# EAGLE design DefenderV1 (EAGLE 7.3.0)
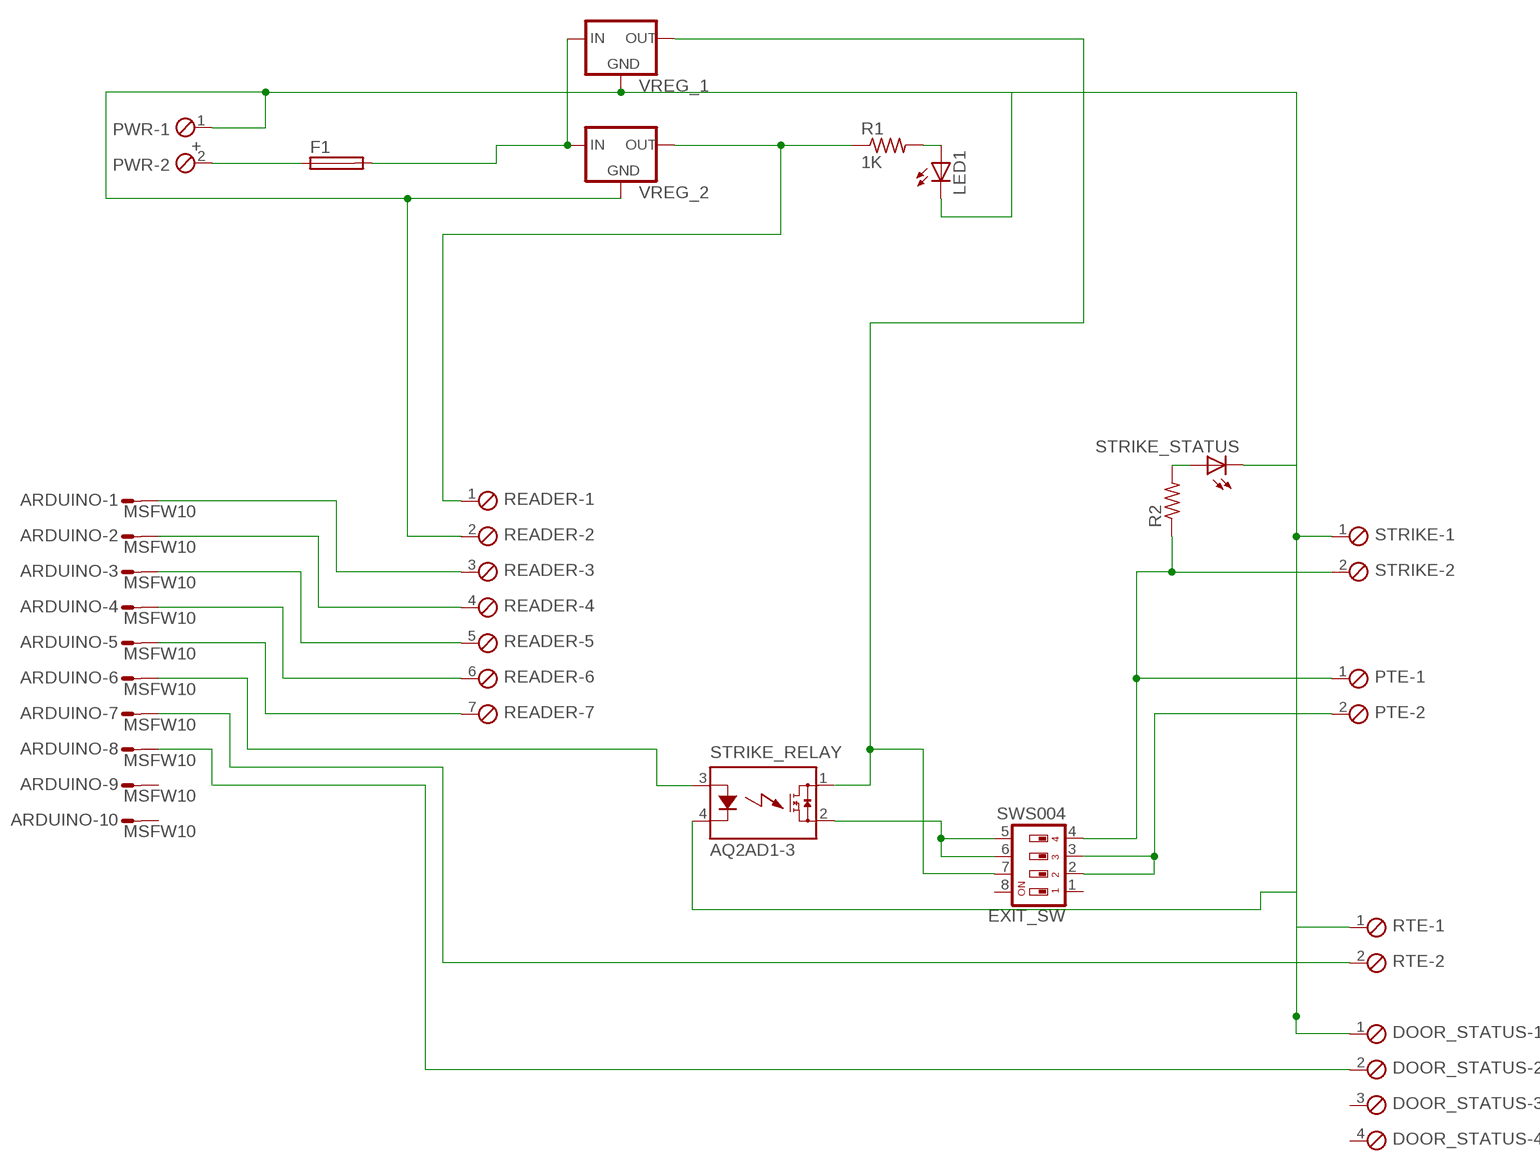
[diagram p0: schematic, sheet 1]

## Parts
ARDUINO  MSFW10  [MSFW10]
DOOR_STATUS  MPT4  [4POL254]
EXIT_SW  SWS004  [SMS-004]
F1  GSH15  [GSH15]
LED1  LED5MM  [LED5MM]
PTE  MPT2  [2POL254]
PWR  +  MPT2  [2POL254]
R1  1K  R-US_0204/7  [0204/7]
R2  R-US_0204/7  [0204/7]
READER  MPT7  [7POL254]
RTE  MPT2  [2POL254]
STRIKE  MPT2  [2POL254]
STRIKE_RELAY  AQ2AD1-3  [AQ1]
STRIKE_STATUS  LED5MM  [LED5MM]
VREG_1  78XXL  [78XXL]
VREG_2  78XXL  [78XXL]

## Nets
N$1: F1.2 VREG_1.IN VREG_2.IN
N$2: F1.1 PWR.2
N$4: DOOR_STATUS.1 LED1.K(C) PWR.1 READER.2 RTE.1 STRIKE.1 STRIKE_RELAY.4(K) STRIKE_STATUS.K(C) VREG_1.GND VREG_2.GND
N$5: ARDUINO.1 READER.3
N$6: ARDUINO.2 READER.4
N$8: ARDUINO.3 READER.5
N$9: EXIT_SW.5 EXIT_SW.6 STRIKE_RELAY.2(DS2)
N$10: R2.2 STRIKE_STATUS.A
N$11: ARDUINO.4 READER.6
N$12: EXIT_SW.4 PTE.1 R2.1 STRIKE.2
N$13: EXIT_SW.2 EXIT_SW.3 PTE.2
N$15: LED1.A R1.2
N$16: ARDUINO.5 READER.7
N$17: ARDUINO.6 STRIKE_RELAY.3(A)
N$18: ARDUINO.7 RTE.2
N$19: EXIT_SW.7 STRIKE_RELAY.1(DS1) VREG_1.OUT
N$20: ARDUINO.8 DOOR_STATUS.2
N$22: R1.1 READER.1 VREG_2.OUT
Unconnected: ARDUINO.9 ARDUINO.10 DOOR_STATUS.3 DOOR_STATUS.4 EXIT_SW.1 EXIT_SW.8

## Library data of the parts
ARDUINO = con-lumberg:MSFW10: MSF CONNECTOR; OC_FARNELL: unknown; OC_NEWARK: unknown
DOOR_STATUS = con-phoenix-254:MPT4: PHOENIX CONNECTOR; OC_FARNELL: unknown; OC_NEWARK: unknown
EXIT_SW = smd-special:SWS004: SMD Dip Switch 4 pol.
F1 = fuse:GSH15: FUSE HOLDER grid 15mm, 19649 Wickmann; MPN: 64900001039; OC_FARNELL: 1271673; OC_NEWARK: 02P0318
LED1 STRIKE_STATUS = led:LED: LED OSRAM: - CHIPLED LG R971, LG N971, LY N971, LG Q971, LY Q971, LO R971, LY R971 LH N974, LH R974 LS Q976, LO Q976, LY Q976 LO Q996 - Hyper CHIPLED LW Q18S LB Q993, LB Q99A, LB R99A - SideLED LS A670, LO A670, LY A670, LG A670, LP A670 LB A673, LV A673, LT A673, LW A673 LH A674 LY A675 LS A676, LA A676, LO A676, LY A676, LW A676 LS A679, LY A679, LG A679 - Hyper Micro SIDELED® LS Y876, LA Y876, LO Y876, LY Y876 LT Y87S - SmartLED LW L88C, LW L88S LB L89C, LB L89S, LG L890 LS L89K, LO L89K, LY L89K LS L896, LA L896, LO L896, LY L896 - TOPLED LS T670, LO T670, LY T670, LG T670, LP T670 LSG T670, LSP T670, LSY T670, LOP T670, LYG T670 LG T671, LOG T671, LSG T671 LB T673, LV T673, LT T673, LW T673 LH T674 LS T676, LA T676, LO T676, LY T676, LB T676, LH T676, LSB T676, LW T676 LB T67C, LV T67C, LT T67C, LS T67K, LO T67K, LY T67K, LW E67C LS E67B, LA E67B, LO E67B, LY E67B, LB E67C, LV E67C, LT E67C LW T67C LS T679, LY T679, LG T679 LS T770, LO T770, LY T770, LG T770, LP T770 LB T773, LV T773, LT T773, LW T773 LH T774 LS E675, LA E675, LY E675, LS T675 LS T776, LA T776, LO T776, LY T776, LB T776 LHGB T686 LT T68C, LB T68C - Hyper Mini TOPLED® LB M676 - Mini TOPLED Santana® LG M470 LS M47K, LO M47K, LY M47K Source: http://www.osram.convergy.de LUXEON: - LUMILED® LXK2-PW12-R00, LXK2-PW12-S00, LXK2-PW14-U00, LXK2-PW14-V00 LXK2-PM12-R00, LXK2-PM12-S00, LXK2-PM14-U00 LXK2-PE12-Q00, LXK2-PE12-R00, LXK2-PE12-S00, LXK2-PE14-T00, LXK2-PE14-U00 LXK2-PB12-K00, LXK2-PB12-L00, LXK2-PB12-M00, LXK2-PB14-N00, LXK2-PB14-P00, LXK2-PB14-Q00 LXK2-PR12-L00, LXK2-PR12-M00, LXK2-PR14-Q00, LXK2-PR14-R00 LXK2-PD12-Q00, LXK2-PD12-R00, LXK2-PD12-S00 LXK2-PH12-R00, LXK2-PH12-S00 LXK2-PL12-P00, LXK2-PL12-Q00, LXK2-PL12-R00 Source: www.luxeon.com KINGBRIGHT: KA-3528ASYC Source: www.kingbright.com
PTE PWR RTE STRIKE = con-phoenix-254:MPT2: PHOENIX CONNECTOR; OC_FARNELL: unknown; OC_NEWARK: unknown
R1 R2 = rcl:R-US_: RESISTOR, American symbol
READER = con-phoenix-254:MPT7: PHOENIX CONNECTOR; OC_FARNELL: unknown; OC_NEWARK: unknown
STRIKE_RELAY = relay:AQ*: SOLID STATE RELAY NAiS Source: http://www.mew-europe.com/.. en_ds_61601_0000.pdf; MPN: AQ2AD1-3/28VDC; OC_FARNELL: unknown; OC_NEWARK: 13P1229
VREG_1 VREG_2 = v-reg:78XXL: VOLTAGE REGULATOR

## Board
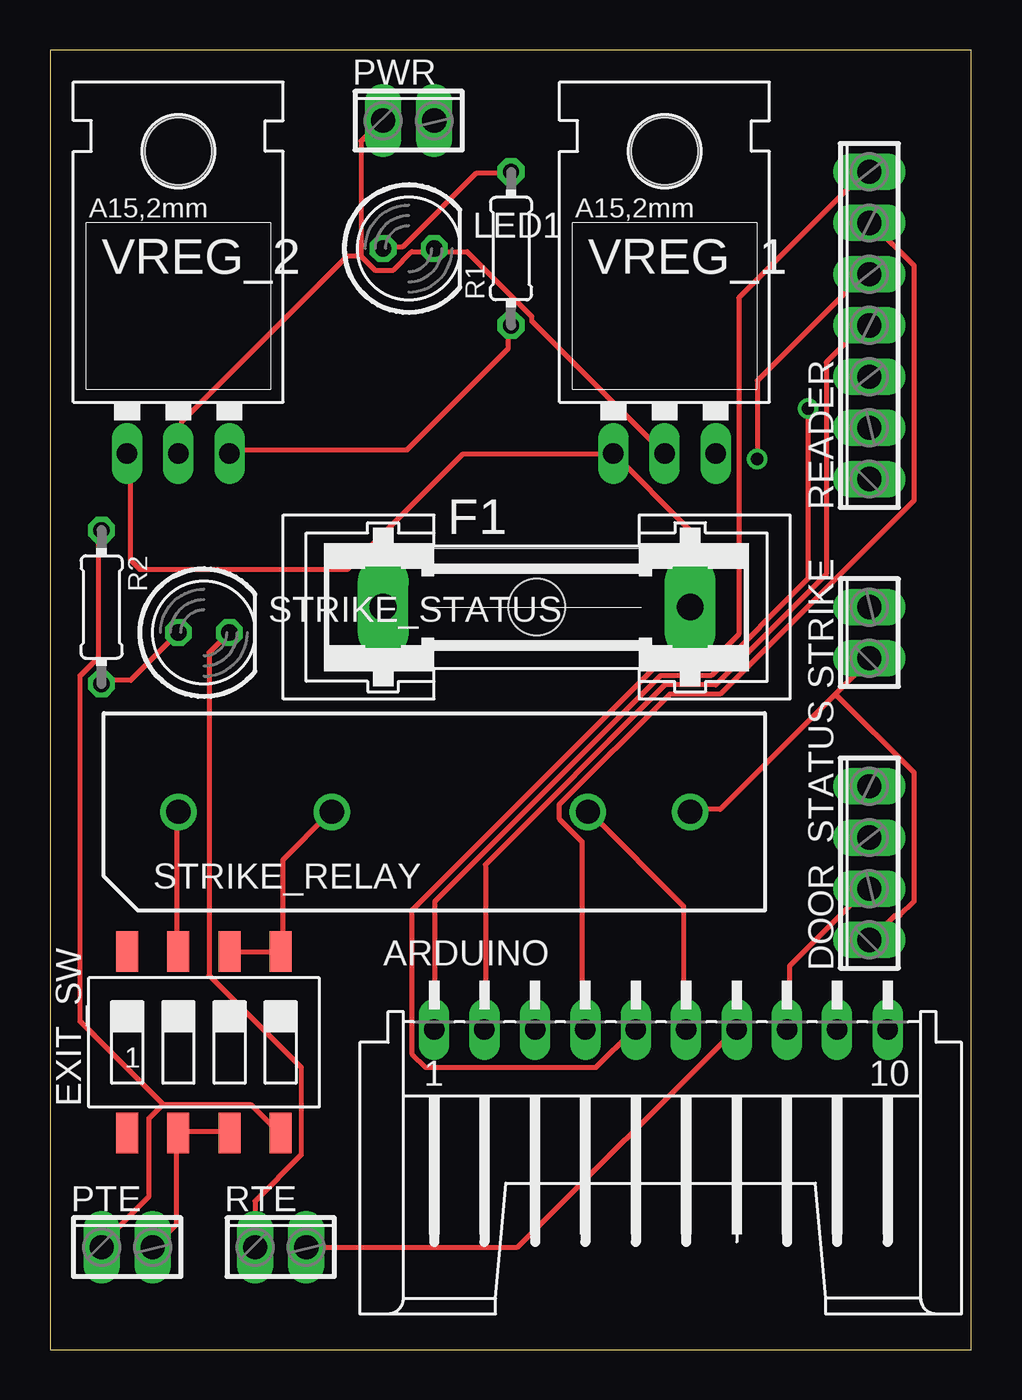
[diagram p1: board, top side]
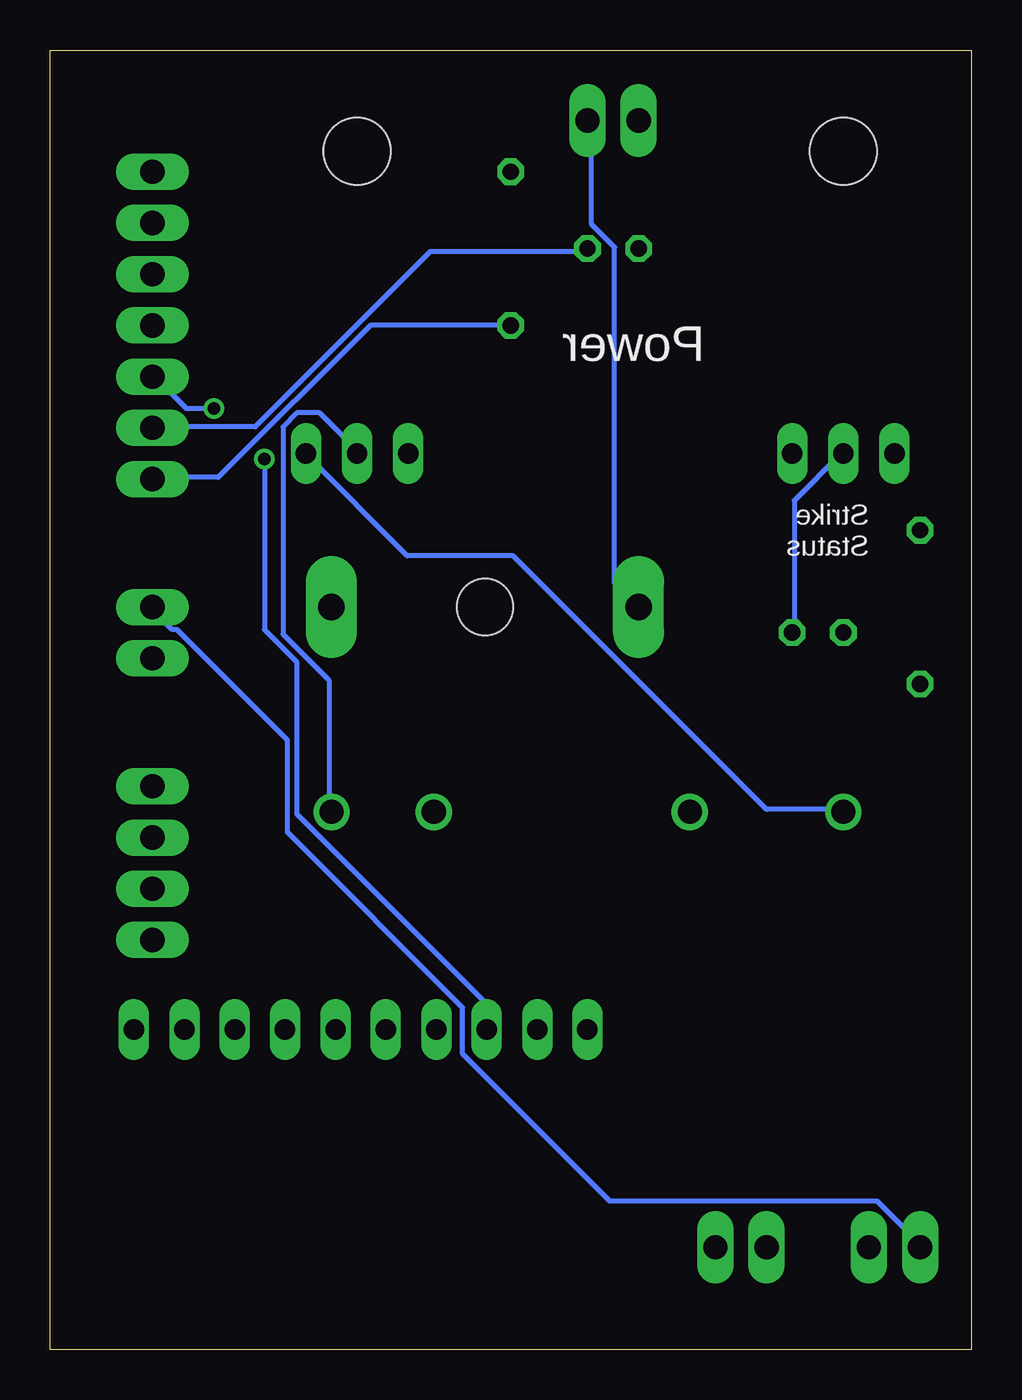
[diagram p2: board, bottom side, seen from below]

Size 45.7 x 64.44 mm. Coordinates in mm from the lower left corner, seen from the top.
Outline: 0,0 45.7,0 45.7,64.44 0,64.44 0,0
Copper layers (1*16): Top 0.035mm / dielectric 1.5mm / Bottom 0.035mm
Design rules "default": minimum track width 10mil, minimum drill 24mil, track to track 8mil, track to pad 8mil, pad to pad 8mil, via to via 8mil, smd to smd 8mil, copper to edge 40mil, drill to drill 8mil, minimum pad ring 10mil, minimum via ring 8mil, stop-mask expansion 4mil, vias tented up to drill 0mil, thermal gap 10mil

### Footprints (pad centres in the part's own frame; a part is rotated, then mirrored left to right if it is on the bottom)
MSFW10 = drill 1.016 long: 1 0,1.905; 2 2.489,1.905; 3 5.004,1.905; 4 7.493,1.905; 5 10.008,1.905; 6 12.497,1.905; 7 15.011,1.905; 8 17.501,1.905; 9 19.99,1.905; 10 22.504,1.905
4POL254 = drill 1.2 long: 1 -3.81,0; 2 -1.27,0; 3 1.27,0; 4 3.81,0
SMS-004 = smd 1.092 x 2.007: 1 -3.81,-4.496; 2 -1.27,-4.496; 3 1.27,-4.496; 4 3.81,-4.496; 5 3.81,4.496; 6 1.27,4.496; 7 -1.27,4.496; 8 -3.81,4.496
GSH15 = drill 1.321 pad 2.54 long: 1 -7.62,0; 2 7.62,0 | hole 2.794: 0,0
LED5MM = drill 0.813 octagon: A -1.27,0; K 1.27,0
2POL254 = drill 1.2 long: 1 -1.27,0; 2 1.27,0
0204/7 = drill 0.813 octagon: 1 -3.81,0; 2 3.81,0
7POL254 = drill 1.2 long: 1 -7.62,0; 2 -5.08,0; 3 -2.54,0; 4 0,0; 5 2.54,0; 6 5.08,0; 7 7.62,0
AQ1 = drill 1.2: 1 -12.7,0; 2 -5.08,0; 3 7.62,0; 4 12.7,0
78XXL = drill 1.016 long: GND 0,-3.81; IN -2.54,-3.81; OUT 2.54,-3.81 | hole 3.302: 0,11.176

### Placement (x,y rotation side)
ARDUINO  19.05,13.97 0 top
DOOR_STATUS  40.64,24.13 90 top
EXIT_SW  7.62,15.24 0 top
F1  24.13,36.83 0 top
LED1  17.78,54.61 0 top
PTE  3.81,5.08 0 top
PWR  17.78,60.96 0 top
R1  22.86,54.61 90 top
R2  2.54,36.83 270 top
READER  40.64,50.8 90 top
RTE  11.43,5.08 0 top
STRIKE  40.64,35.56 90 top
STRIKE_RELAY  19.05,26.67 0 top
STRIKE_STATUS  7.62,35.56 0 top
VREG_1  30.48,48.26 0 top
VREG_2  6.35,48.26 0 top

### Tracks (layer width: path | path; a pad name or v marks a point on that pad's centre or on a via)
N$1
  Top 0.254: VREG_2.IN 3.99,44.4 3.99,39.14 4.45,38.68 14.73,38.68 20.45,44.4 27.76,44.4 VREG_1.IN 31.65,40.74 31.65,36.86 F1.2
N$2
  Bottom 0.254: PWR.2 18.85,60.86 18.85,55.83 17.7,54.69 17.7,38 16.56,36.86 F1.1
N$4
  Top 0.254: RTE.1 10.16,7.37 12.45,9.65 12.45,13.99 7.87,18.57 7.87,34.57 8.79,35.48 STRIKE_STATUS.K | 38.96,32.51 40.56,34.11 STRIKE.1 | 38.96,32.51 33.25,26.8 31.88,26.8 STRIKE_RELAY.4 | 38.96,32.51 42.85,28.63 42.85,22.23 42.16,21.54 41.94,21.54 40.79,20.4 DOOR_STATUS.1 | 15.42,54.23 16.1,53.54 17.02,53.54 17.93,54.46 18.85,54.46 LED1.K 19.08,54.46 20.68,54.46 23.88,51.26 23.88,51.03 30.28,44.63 VREG_1.GND | 15.42,54.23 15.42,59.94 16.33,60.86 PWR.1 | 15.42,54.23 14.73,54.23 6.5,46 6.5,44.63 VREG_2.GND
  Bottom 0.254: STRIKE_STATUS.K 8.79,35.71 8.79,42.11 6.5,44.4 VREG_2.GND | READER.2 40.56,45.77 35.53,45.77 26.85,54.46 19.08,54.46 LED1.K | STRIKE_RELAY.4 31.88,26.8 31.88,33.2 34.16,35.48 34.16,45.77 33.48,46.46 32.33,46.46 30.5,44.63 VREG_1.GND
N$5  (via drill 0.61)
  Top 0.254: v37.59,46.69 37.59,38.23 32.79,33.43 30.28,33.43 19.08,22.23 19.08,16.05 ARDUINO.1
  Bottom 0.254: v37.59,46.69 38.96,46.69 40.56,48.28 READER.3
N$6
  Top 0.254: READER.4 40.33,50.8 38.51,48.97 38.51,38.46 33.02,32.97 30.5,32.97 21.59,24.05 21.59,16.05 ARDUINO.2
N$8  (via drill 0.61)
  Top 0.254: v35.08,44.17 35.08,48.06 40.56,53.54 READER.5
  Bottom 0.254: v35.08,44.17 35.08,35.71 33.48,34.11 33.48,26.57 24.11,17.2 24.11,16.05 ARDUINO.3
N$9
  Top 0.254: EXIT_SW.6 9.02,19.71 11.3,19.71 EXIT_SW.5 11.53,19.94 11.53,24.28 13.82,26.57 STRIKE_RELAY.2
N$10
  Top 0.254: STRIKE_STATUS.A 3.99,33.2 2.62,33.2 R2.2
N$11
  Top 0.254: ARDUINO.4 26.39,16.05 26.39,25.2 25.25,26.34 25.25,27.03 30.73,32.51 33.25,32.51 42.85,42.11 42.85,53.77 40.79,55.83 READER.6
N$12
  Top 0.254: 5.59,12.17 9.93,12.17 11.3,10.8 EXIT_SW.4 | 5.59,12.17 4.9,11.48 4.9,7.59 2.39,5.08 PTE.1 | 5.59,12.17 1.47,16.28 1.47,33.43 2.39,34.34 2.39,40.51 R2.1
  Bottom 0.254: STRIKE.2 40.56,36.63 39.65,35.71 39.42,35.71 33.93,30.23 33.93,25.65 25.25,16.97 25.25,14.68 17.93,7.37 4.67,7.37 2.39,5.08 PTE.1
N$13
  Top 0.254: EXIT_SW.3 8.79,10.8 6.5,10.8 EXIT_SW.2 6.27,10.57 6.27,6.22 5.13,5.08 PTE.2
N$15
  Top 0.254: LED1.A 16.56,54.69 17.47,54.69 21.13,58.34 22.73,58.34 R1.2
N$16
  Top 0.254: ARDUINO.5 28.91,15.82 27.08,13.99 18.62,13.99 17.93,14.68 17.93,21.77 30.05,33.88 32.56,33.88 34.16,35.48 34.16,52.17 40.56,58.57 READER.7
N$17
  Top 0.254: ARDUINO.6 31.42,16.05 31.42,22 26.85,26.57 STRIKE_RELAY.3
N$18
  Top 0.254: RTE.2 23.19,5.08 33.93,15.82 ARDUINO.7
N$19
  Top 0.254: EXIT_SW.7 6.27,19.94 6.27,26.57 STRIKE_RELAY.1
  Bottom 0.254: VREG_1.OUT 33.02,44.4 27.99,39.37 22.73,39.37 10.16,26.8 6.5,26.8 STRIKE_RELAY.1
N$20
  Top 0.254: ARDUINO.8 36.68,16.05 36.68,19.02 40.56,22.91 DOOR_STATUS.2
N$22
  Top 0.254: R1.1 22.73,50.8 22.73,49.66 17.7,44.63 9.02,44.63 VREG_2.OUT
  Bottom 0.254: R1.1 29.82,50.8 37.36,43.26 40.56,43.26 READER.1

### Text on the board
bNames: Power | Strike / Status
Document: Warden Defender V1.0